# Altium schematic sheet FSP+.SchDoc: {Наименование}
size 420 x 297 mm; DocumentNumber: ПЛАС.ХХХХХХ.ХХХ ХХ; SheetNumber: 10; SheetTotal: 11; PageSetup: Record=PageOptions|CenterHorizontal=False|CenterVertical=False|PrintScale=0.95|XCorrection=0.00|YCorrection=0.00|PrintKind=1|BorderSize=5000000|LeftOffset=0|BottomOffset=0|Orientation=1|PaperLength=1000|PaperWidth=1000|Scale=100|PaperSource=15|PrintQuality=600|MediaType=1|DitherType=10|PaperKind=A4|PrintScaleMode=1; Rule: PcbType=ProtelPcb
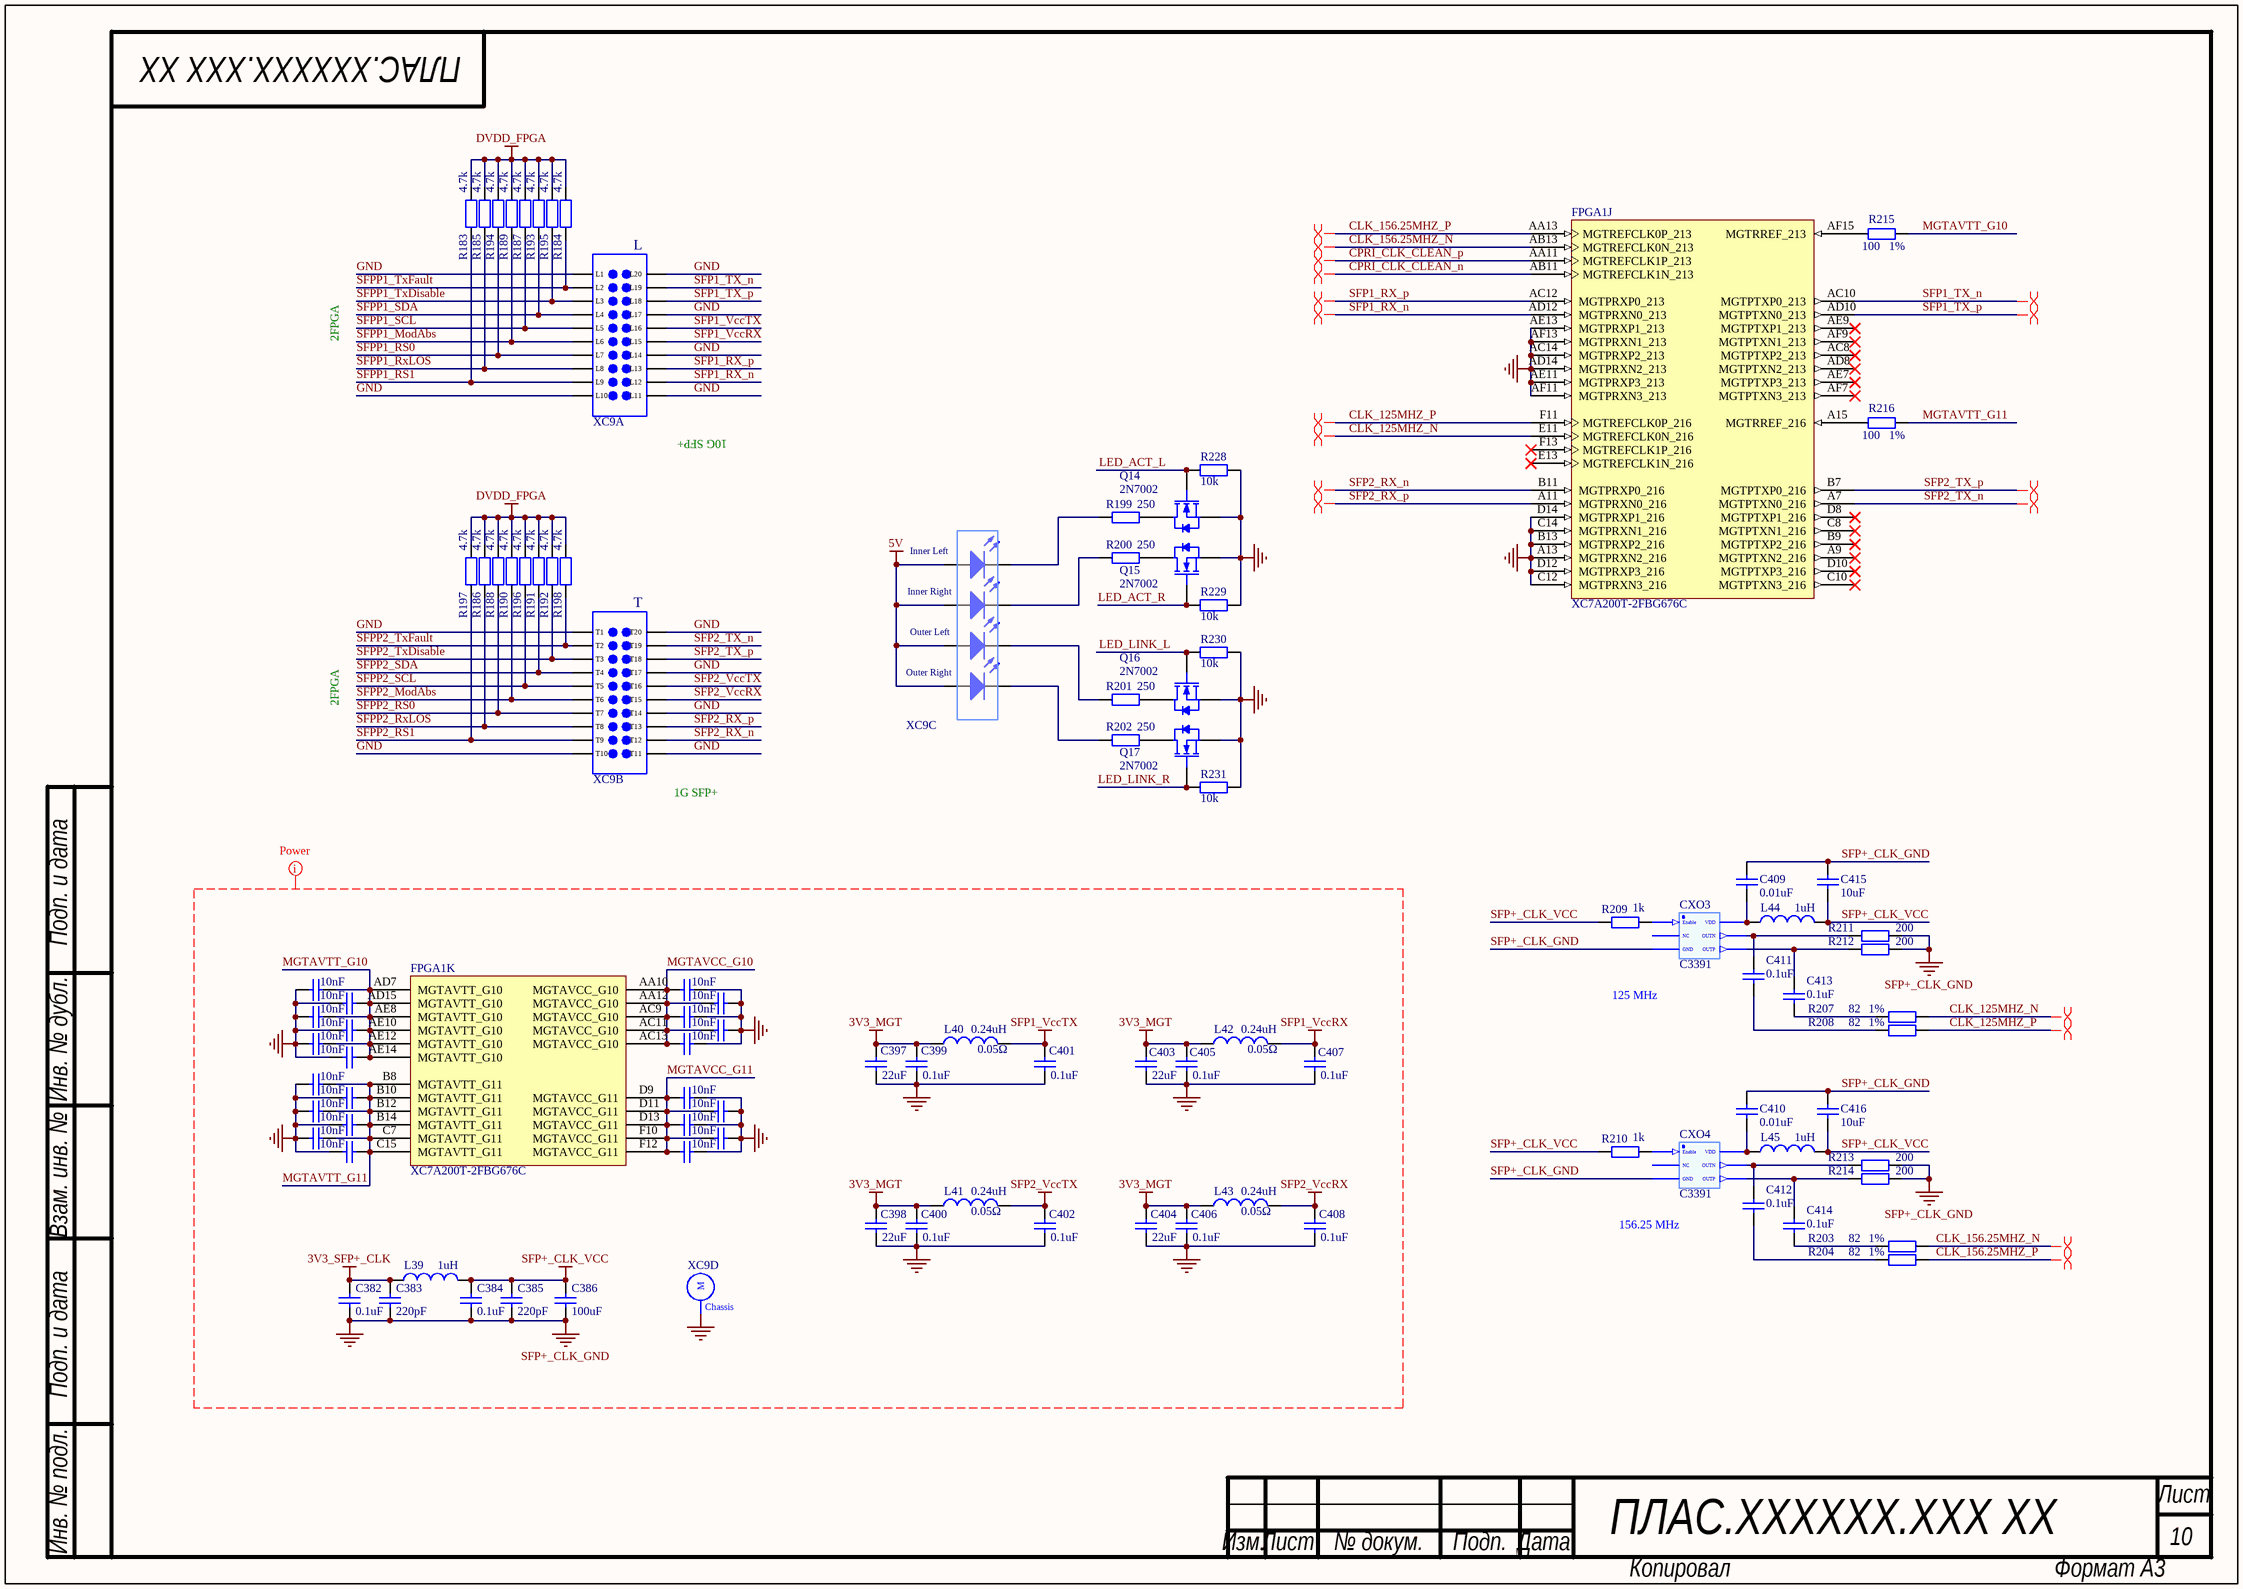
[diagram p0: FSP+.SchDoc]

## Parts
C370  value 10nF  [С0402]  (hidden comment: Cap)
C371  value 10nF  [С0402]  (hidden comment: Cap)
C372  value 10nF  [С0402]  (hidden comment: Cap)
C373  value 10nF  [С0402]  (hidden comment: Cap)
C374  value 10nF  [С0402]  (hidden comment: Cap)
C375  value 10nF  [С0402]  (hidden comment: Cap)
C376  value 10nF  [С0402]  (hidden comment: Cap)
C377  value 10nF  [С0402]  (hidden comment: Cap)
C378  value 10nF  [С0402]  (hidden comment: Cap)
C379  value 10nF  [С0402]  (hidden comment: Cap)
C380  value 10nF  [С0402]  (hidden comment: Cap)
C381  value 10nF  [С0402]  (hidden comment: Cap)
C382  value 0.1uF  [C0603]  (hidden comment: Cap)
C383  value 220pF  [C0603]  (hidden comment: Cap)
C384  value 0.1uF  [C0603]  (hidden comment: Cap)
C385  value 220pF  [C0603]  (hidden comment: Cap)
C386  value 100uF  [C1210]  (hidden comment: Cap)
C387  value 10nF  [С0402]  (hidden comment: Cap)
C388  value 10nF  [С0402]  (hidden comment: Cap)
C389  value 10nF  [С0402]  (hidden comment: Cap)
C390  value 10nF  [С0402]  (hidden comment: Cap)
C391  value 10nF  [С0402]  (hidden comment: Cap)
C392  value 10nF  [С0402]  (hidden comment: Cap)
C393  value 10nF  [С0402]  (hidden comment: Cap)
C394  value 10nF  [С0402]  (hidden comment: Cap)
C395  value 10nF  [С0402]  (hidden comment: Cap)
C396  value 10nF  [С0402]  (hidden comment: Cap)
C397  value 22uF  [C0805]  (hidden comment: Cap)
C398  value 22uF  [C0805]  (hidden comment: Cap)
C399  value 0.1uF  [C0805]  (hidden comment: Cap)
C400  value 0.1uF  [C0805]  (hidden comment: Cap)
C401  value 0.1uF  [C0805]  (hidden comment: Cap)
C402  value 0.1uF  [C0805]  (hidden comment: Cap)
C403  value 22uF  [C0805]  (hidden comment: Cap)
C404  value 22uF  [C0805]  (hidden comment: Cap)
C405  value 0.1uF  [C0805]  (hidden comment: Cap)
C406  value 0.1uF  [C0805]  (hidden comment: Cap)
C407  value 0.1uF  [C0805]  (hidden comment: Cap)
C408  value 0.1uF  [C0805]  (hidden comment: Cap)
C409  value 0.01uF  [C0603]  (hidden comment: Cap)
C410  value 0.01uF  [C0603]  (hidden comment: Cap)
C411  value 0.1uF  [С0402]  (hidden comment: Cap)
C412  value 0.1uF  [С0402]  (hidden comment: Cap)
C413  value 0.1uF  [С0402]  (hidden comment: Cap)
C414  value 0.1uF  [С0402]  (hidden comment: Cap)
C415  value 10uF  [C0603]  (hidden comment: Cap)
C416  value 10uF  [C0603]  (hidden comment: Cap)
CXO3  C3391  Frequency: 125 MHz  [5x7 CXO LVPECL]
CXO4  C3391  Frequency: 156.25 MHz  [5x7 CXO LVPECL]
FPGA1  XC7A200T-2FBG676C  [FGG676]  (parts J,K of 14)
L39  value 1uH  [L1210_Murata]  (hidden comment: Inductor_LF)
L40  value 0.24uH  DCR: 0.05Ω  [L0805_Murata_LQG]  (hidden comment: Inductor_LF)
L41  value 0.24uH  DCR: 0.05Ω  [L0805_Murata_LQG]  (hidden comment: Inductor_LF)
L42  value 0.24uH  DCR: 0.05Ω  [L0805_Murata_LQG]  (hidden comment: Inductor_LF)
L43  value 0.24uH  DCR: 0.05Ω  [L0805_Murata_LQG]  (hidden comment: Inductor_LF)
L44  value 1uH  [L1206_Murata]  (hidden comment: Inductor_LF)
L45  value 1uH  [L1206_Murata]  (hidden comment: Inductor_LF)
Q14  2N7002  [SOT-23]
Q15  2N7002  [SOT-23]
Q16  2N7002  [SOT-23]
Q17  2N7002  [SOT-23]
R183  value 4.7k  [R0402]  (hidden comment: Res)
R184  value 4.7k  [R0402]  (hidden comment: Res)
R185  value 4.7k  [R0402]  (hidden comment: Res)
R186  value 4.7k  [R0402]  (hidden comment: Res)
R187  value 4.7k  [R0402]  (hidden comment: Res)
R188  value 4.7k  [R0402]  (hidden comment: Res)
R189  value 4.7k  [R0402]  (hidden comment: Res)
R190  value 4.7k  [R0402]  (hidden comment: Res)
R191  value 4.7k  [R0402]  (hidden comment: Res)
R192  value 4.7k  [R0402]  (hidden comment: Res)
R193  value 4.7k  [R0402]  (hidden comment: Res)
R194  value 4.7k  [R0402]  (hidden comment: Res)
R195  value 4.7k  [R0402]  (hidden comment: Res)
R196  value 4.7k  [R0402]  (hidden comment: Res)
R197  value 4.7k  [R0402]  (hidden comment: Res)
R198  value 4.7k  [R0402]  (hidden comment: Res)
R199  value 250  [R0805]  (hidden comment: Res)
R200  value 250  [R0805]  (hidden comment: Res)
R201  value 250  [R0805]  (hidden comment: Res)
R202  value 250  [R0805]  (hidden comment: Res)
R203  value 82  Tolerance: 1%  [R0402]  (hidden comment: Res)
R204  value 82  Tolerance: 1%  [R0402]  (hidden comment: Res)
R207  value 82  Tolerance: 1%  [R0402]  (hidden comment: Res)
R208  value 82  Tolerance: 1%  [R0402]  (hidden comment: Res)
R209  value 1k  [R0402]  (hidden comment: Res)
R210  value 1k  [R0402]  (hidden comment: Res)
R211  value 200  [R0402]  (hidden comment: Res)
R212  value 200  [R0402]  (hidden comment: Res)
R213  value 200  [R0402]  (hidden comment: Res)
R214  value 200  [R0402]  (hidden comment: Res)
R215  value 100  Tolerance: 1%  [R0603]  (hidden comment: Res)
R216  value 100  Tolerance: 1%  [R0603]  (hidden comment: Res)
R228  value 10k  [R0402]  (hidden comment: Res)
R229  value 10k  [R0402]  (hidden comment: Res)
R230  value 10k  [R0402]  (hidden comment: Res)
R231  value 10k  [R0402]  (hidden comment: Res)
XC9  SFP+  [SFP+ Light Pipe]  (value not drawn)  (parts A,B,C,D of 4)

## Nets
3V3_MGT: C397.2 C398.1 C399.1 C400.2 C403.2 C404.2 C405.1 C406.1 L40.1 L41.2 L42.1 L43.2
3V3_SFP+_CLK: C382.1 C383.1 L39.2
5V: XC9.INL_2(A) XC9.INR_2(A) XC9.OUTL_2(A) XC9.OUTR_2(A)
DVDD_FPGA: R183.2 R184.2 R185.2 R186.2 R187.2 R188.2 R189.2 R190.2 R191.2 R192.2 R193.2 R194.2 R195.2 R196.2 R197.2 R198.2
GND: C370.2 C371.1 C372.1 C373.2 C374.2 C375.2 C376.2 C377.2 C378.2 C379.1 C380.1 C381.2 C382.2 C383.2 C384.2 C385.2 C386.1 C387.1 C388.2 C389.1 C390.2 C391.2 C392.1 C393.2 C394.2 C395.2 C396.2 C397.1 C398.2 C399.2 C400.1 C401.2 C402.2 C403.1 C404.1 C405.2 C406.2 C407.2 C408.2 C409.2 C410.2 C415.1 C416.1 CXO3.3(GND) CXO4.3(GND) FPGA1.A13(MGTPRXN2_216) FPGA1.AC14(MGTPRXP2_213) FPGA1.AD14(MGTPRXN2_213) FPGA1.AE11(MGTPRXP3_213) FPGA1.AE13(MGTPRXP1_213) FPGA1.AF11(MGTPRXN3_213) FPGA1.AF13(MGTPRXN1_213) FPGA1.B13(MGTPRXP2_216) FPGA1.C12(MGTPRXN3_216) FPGA1.C14(MGTPRXN1_216) FPGA1.D12(MGTPRXP3_216) FPGA1.D14(MGTPRXP1_216) Q14.2(S) Q15.2(S) Q16.2(S) Q17.2(S) R211.1 R212.1 R213.1 R214.1 R228.2 R229.2 R230.2 R231.2 XC9.0(M) XC9.L1 XC9.L10 XC9.L11 XC9.L14 XC9.L17 XC9.L20 XC9.T1 XC9.T10 XC9.T11 XC9.T14 XC9.T17 XC9.T20  [also labelled SFP+_CLK_GND]
SFP1_VccRX: C407.1 L42.2 XC9.L15
SFP1_VccTX: C401.1 L40.2 XC9.L16
SFP2_VccRX: C408.1 L43.1 XC9.T15
SFP2_VccTX: C402.1 L41.1 XC9.T16
SFP+_CLK_VCC: C384.1 C385.1 C386.2 C415.2 C416.2 L39.1 L44.1 L45.1 R209.1 R210.1
CLK_125MHZ_N: FPGA1.E11(MGTREFCLK0N_216) R207.2
CLK_125MHZ_P: FPGA1.F11(MGTREFCLK0P_216) R208.2
CLK_156.25MHZ_N: FPGA1.AB13(MGTREFCLK0N_213) R203.2
CLK_156.25MHZ_P: FPGA1.AA13(MGTREFCLK0P_213) R204.2
CPRI_CLK_CLEAN_n: FPGA1.AB11(MGTREFCLK1N_213)
CPRI_CLK_CLEAN_p: FPGA1.AA11(MGTREFCLK1P_213)
LED_ACT_L: Q14.1(G) R228.1
LED_ACT_R: Q15.1(G) R229.1
LED_LINK_L: Q16.1(G) R230.1
LED_LINK_R: Q17.1(G) R231.1
MGTAVCC_G10: C387.2 C388.1 C389.2 C393.1 C394.1 FPGA1.AA10(MGTAVCC_G10) FPGA1.AA12(MGTAVCC_G10) FPGA1.AC9(MGTAVCC_G10) FPGA1.AC11(MGTAVCC_G10) FPGA1.AC13(MGTAVCC_G10)
MGTAVCC_G11: C390.1 C391.1 C392.2 C395.1 C396.1 FPGA1.D9(MGTAVCC_G11) FPGA1.D11(MGTAVCC_G11) FPGA1.D13(MGTAVCC_G11) FPGA1.F10(MGTAVCC_G11) FPGA1.F12(MGTAVCC_G11)
MGTAVTT_G10: C370.1 C371.2 C372.2 C376.1 C377.1 C378.1 FPGA1.AD7(MGTAVTT_G10) FPGA1.AD15(MGTAVTT_G10) FPGA1.AE8(MGTAVTT_G10) FPGA1.AE10(MGTAVTT_G10) FPGA1.AE12(MGTAVTT_G10) FPGA1.AE14(MGTAVTT_G10) R215.1
MGTAVTT_G11: C373.1 C374.1 C375.1 C379.2 C380.2 C381.1 FPGA1.B8(MGTAVTT_G11) FPGA1.B10(MGTAVTT_G11) FPGA1.B12(MGTAVTT_G11) FPGA1.B14(MGTAVTT_G11) FPGA1.C7(MGTAVTT_G11) FPGA1.C15(MGTAVTT_G11) R216.1
SFP1_RX_n: FPGA1.AD12(MGTPRXN0_213) XC9.L12
SFP1_RX_p: FPGA1.AC12(MGTPRXP0_213) XC9.L13
SFP1_TX_n: FPGA1.AC10(MGTPTXP0_213) XC9.L19
SFP1_TX_p: FPGA1.AD10(MGTPTXN0_213) XC9.L18
SFP2_RX_n: FPGA1.B11(MGTPRXP0_216) XC9.T12
SFP2_RX_p: FPGA1.A11(MGTPRXN0_216) XC9.T13
SFP2_TX_n: FPGA1.A7(MGTPTXN0_216) XC9.T19
SFP2_TX_p: FPGA1.B7(MGTPTXP0_216) XC9.T18
SFPP1_ModAbs: R189.1 XC9.L6
SFPP1_RS0: R194.1 XC9.L7
SFPP1_RS1: R183.1 XC9.L9
SFPP1_RxLOS: R185.1 XC9.L8
SFPP1_SCL: R187.1 XC9.L5
SFPP1_SDA: R193.1 XC9.L4
SFPP1_TxDisable: R195.1 XC9.L3
SFPP1_TxFault: R184.1 XC9.L2
SFPP2_ModAbs: R190.1 XC9.T6
SFPP2_RS0: R188.1 XC9.T7
SFPP2_RS1: R197.1 XC9.T9
SFPP2_RxLOS: R186.1 XC9.T8
SFPP2_SCL: R196.1 XC9.T5
SFPP2_SDA: R191.1 XC9.T4
SFPP2_TxDisable: R192.1 XC9.T3
SFPP2_TxFault: R198.1 XC9.T2
NetC409_1: C409.1 CXO3.6(VDD) L44.2
NetC410_1: C410.1 CXO4.6(VDD) L45.2
NetC411_1: C411.1 R208.1
NetC411_2: C411.2 CXO3.5(OUTN) R211.2
NetC412_1: C412.1 R204.1
NetC412_2: C412.2 CXO4.5(OUTN) R213.2
NetC413_1: C413.1 R207.1
NetC413_2: C413.2 CXO3.4(OUTP) R212.2
NetC414_1: C414.1 R203.1
NetC414_2: C414.2 CXO4.4(OUTP) R214.2
NetCXO3_1: CXO3.1(Enable) R209.2
NetCXO4_1: CXO4.1(Enable) R210.2
NetFPGA1_A15: FPGA1.A15(MGTRREF_216) R216.2
NetFPGA1_AF15: FPGA1.AF15(MGTRREF_213) R215.2
NetQ14_3: Q14.3(D) R199.1
NetQ15_3: Q15.3(D) R200.2
NetQ16_3: Q16.3(D) R201.1
NetQ17_3: Q17.3(D) R202.2
NetR199_2: R199.2 XC9.INL_1(K)
NetR200_1: R200.1 XC9.INR_1(K)
NetR201_2: R201.2 XC9.OUTL_1(K)
NetR202_1: R202.1 XC9.OUTR_1(K)

Not connected (* = marked no-connect by the designer): CXO3 2(NC); CXO4 2(NC); FPGA1 A9(MGTPTXN2_216)* AC8(MGTPTXP2_213)* AD8(MGTPTXN2_213)* AE7(MGTPTXP3_213)* AE9(MGTPTXP1_213)* AF7(MGTPTXN3_213)* AF9(MGTPTXN1_213)* B9(MGTPTXP2_216)* C8(MGTPTXN1_216)* C10(MGTPTXN3_216)* D8(MGTPTXP1_216)* D10(MGTPTXP3_216)* E13(MGTREFCLK1N_216)* F13(MGTREFCLK1P_216)*

## Layout directives
net class Power: 3V3_MGT, 3V3_SFP+_CLK, GND, MGTAVCC_G10, MGTAVCC_G11, MGTAVTT_G10, MGTAVTT_G11, SFP1_VccRX, SFP1_VccTX, SFP2_VccRX, SFP2_VccTX, SFP+_CLK_GND, SFP+_CLK_VCC
differential pair: CLK_125MHZ_N, CLK_125MHZ_P, CLK_156.25MHZ_N, CLK_156.25MHZ_P, CPRI_CLK_CLEAN_n, CPRI_CLK_CLEAN_p, SFP1_RX_n, SFP1_RX_p, SFP1_TX_n, SFP1_TX_p, SFP2_RX_n, SFP2_RX_p, SFP2_TX_n, SFP2_TX_p

## Notes on the sheet
- 2FPGA
- (near XC9) 10G SFP+
- (near XC9) 1G SFP+
- Подп. и дата
- Инв. № дубл.
- Взам. инв. №
- Инв. № подл.
- Лист
- Изм.
- № докум.
- Подп.
- Дата
- Копировал
- Формат А3
- (in symbol SFP+_2X1, part A) L
- (in symbol SFP+_2X1, part B) T
- (in symbol SFP+_2X1, part C) Inner Left; Inner Right; Outer Left; Outer Right
- (in symbol SFP+_2X1, part D) Chassis

## Library data of the parts
C370-C381 C387-C396 = Cer Cap: Cer Cap Small; Manufacturer: Murata; Material: x7r; Voltage: 25V; Tolerance: 10%; Type: Ceramic; PackageReference: SMD Chip Capacitor; Package: 0402
C382-C385 = Cer Cap: Cer Cap Small; Manufacturer: Murata; Material: x5r; Voltage: 16V; Tolerance: 10%; Type: Ceramic; PackageReference: SMD Chip Capacitor; Package: 0603
C386 = Cap uF: Cer Cap Large; Manufacturer: Murata; Material: x5r; Tolerance: 20%; Voltage: 6.3V; Type: Ceramic; Package: C1210; PackageDescription: SMD Chip Capacitor
C397 C398 C403 C404 = Cer Cap: Cer Cap Small; Manufacturer: Murata; Material: x5r; Voltage: 6.3V; Tolerance: 10%; Type: Ceramic; PackageReference: SMD Chip Capacitor; Package: 0805
C399-C402 C405-C410 = Cer Cap: Cer Cap Small; Manufacturer: Murata; Material: x5r; Voltage: 50V; Tolerance: 10%; Type: Ceramic; PackageReference: SMD Chip Capacitor
  C399-C402 C405-C408: Package: 0805
  C409 C410: Package: 0603
C411-C414 = Cer Cap: Cer Cap Small; Manufacturer: Murata; Material: x7r; Voltage: 16V; Tolerance: 10%; Type: Ceramic; PackageReference: SMD Chip Capacitor; Package: 0402
C415 C416 = Cer Cap: Cer Cap Small; Manufacturer: Murata; Material: x7r; Voltage: 6.3V; Tolerance: 10%; Type: Ceramic; PackageReference: SMD Chip Capacitor; Package: 0402
CXO3 = 5x7 LVPECL CXO: Crystal Oscillator; Manufacturer: Crystek; Name: CCPD - 033 - 25 - 125.000; Voltage: 3.3V ±0.3V; Output: Differential LVPECL; Input Current: 15mA Typical; Stability: ± 25ppm; Package: 5×7 mm SMD; Temperature Range: 0°C to +70°C; Type: 3.3V, LVPECL
CXO4 = 5x7 LVPECL CXO: Crystal Oscillator; Manufacturer: Crystek; Name: CCPD - 033 - 25 - 156.250; Voltage: 3.3V ±0.3V; Output: Differential LVPECL; Input Current: 15mA Typical; Stability: ± 25ppm; Package: 5×7 mm SMD; Temperature Range: 0°C to +70°C; Type: 3.3V, LVPECL
FPGA1 = XC7A200T-2FBG676C: Artix-7 FPGA, 400 User I/Os, 8 GTP, 676-Ball BGA, Speed Grade 2, Commercial Grade, Pb-Free; Manufacturer: Xilinx; Block RAM Blocks (18Kb): 730; Block RAM Blocks (36Kb): 365; Block RAM Blocks (Max Kb): 13140; CLBs (Slices): 33650; Clock Mgmt Tiles (CMTs): 10; DSP48E1 Slices: 740; Logic Cells: 215360; Max User I/O: 500; Speed Grade: -2; DatasheetVersion: v1.12; PackageVersion: Rev 1.8; PackageReference: FBG676; PackageDescription: Flip-Chip Lidless BGA, Body 27 x 27 mm, 1.0 mm Pitch; Supplier 1: Digi-Key; Supplier Part Number 1: 122-1865-ND; CLBs (Max Distributed RAM Kb): 2888; Generic Part Number: XC7A200T; RoHS: Pb-Free; NexusDeviceID: XC7A200T-2FBG676C; Mounting Technology: Surface Mount; Code_JEDEC: MS-034; PartNumber: XC7A200T-2FBG676C; ComponentLink1Description: Manufacturer URL; ComponentLink1URL: http://www.xilinx.com/; ComponentLink2Description: Datasheet; ComponentLink2URL: http://www.xilinx.com/support/documentation/data_sheets/ds180_7Series_Overview.pdf; ComponentLink3Description: Package Specification; ComponentLink3URL: http://www.xilinx.com/support/documentation/user_guides/ug475_7Series_Pkg_Pinout.pdf; ComponentLink4Description: DC and Switching Characteristics; ComponentLink4URL: http://www.xilinx.com/support/documentation/data_sheets/ds181_Artix_7_Data_Sheet.pdf; ComponentLink5Description: Package File; ComponentLink5URL: http://www.xilinx.com/support/packagefiles/a7packages/xc7a200tfbg676pkg.txt; ComponentLink6Description: Packaging and Pinout; ComponentLink6URL: http://www.xilinx.com/support/documentation/user_guides/ug475_7Series_Pkg_Pinout.pdf
L39 = Inductor_LF: Inductor_Power_Lines; Manufacturer: Murata; Name: LQM32PN1R0MG0; Tolerance: 5%; Current: 1800mA; Frequency: 40MHz; Package: 1210; PackageDescription: Chip Inductor; Temperature Range: -25…85; Series: LQM
L40-L43 = Inductor_LF: Inductor_Power_Lines; Manufacturer: Murata; Name: LQM21PNR24MEH; Tolerance: ±20%; Current: 2.4A; Frequency: 130MHz; Package: 0805; PackageDescription: Chip Inductor; Temperature Range: -25…85; Series: LQM
L44 L45 = Inductor_LF: Inductor_Power_Lines; Manufacturer: Murata; Name: LQM31PN1R0M00; Tolerance: 5%; Current: 1200mA; Frequency: 60MHz; Package: 1206; PackageDescription: Chip Inductor; Temperature Range: -25…85; Series: LQM
Q14-Q17 = 2N7002: N-Channel MOSFET 2N7002; Current: 300mA; Voltage: 60V; Channel Resistance: 5Ohm; Power Dissipation: 0.83W; Name: 2N7002; Type: N-Channel MOSFET; Package: SOT-23
R183-R198 R209-R214 R228-R231 = Res: Resistor; Name: Chip SMD Resistor; Tolerance: 5%; Power: 0.062 Wt; Temperature Range: -55…155
  R183-R198 R228-R231: Package: 0402
  R209-R214: Package: SMD
R199-R202 = Res: Resistor; Name: Chip SMD Resistor; Tolerance: 5%; Power: 0.125W; Package: SMD; Temperature Range: -55…155
R203 R204 R207 R208 R215 R216 = Res: Resistor; Name: Chip SMD Resistor; Power: 0.062 Wt; Temperature Range: -55…155
  R203 R204 R207 R208: Package: SMD
  R215 R216: Package: 0603
XC9 = SFP+_2X1: SFP+ 1 by 2 Connector; Manufacturer: Molex; LEDS Manufacturer: Kingbright; Name: SFP+ Connector 76044 Series; P/N: 0760445001; LEDS Green x2 P/N: APHCM2012CGCK-F01; LEDS Orange x2 P/N: APHCM2012SECK-F01; Type: 40-pin (2x20 pin) SFP+ Connector; Mounting Type: Through Hole, Right Angle; Termination: Press-Fit; Features: Board Guide, EMI Shielded, Light Pipe